# EAGLE design LB_BIT_i18_MOTIONTRIGGER-v02(rev1) (EAGLE 6.6.0)
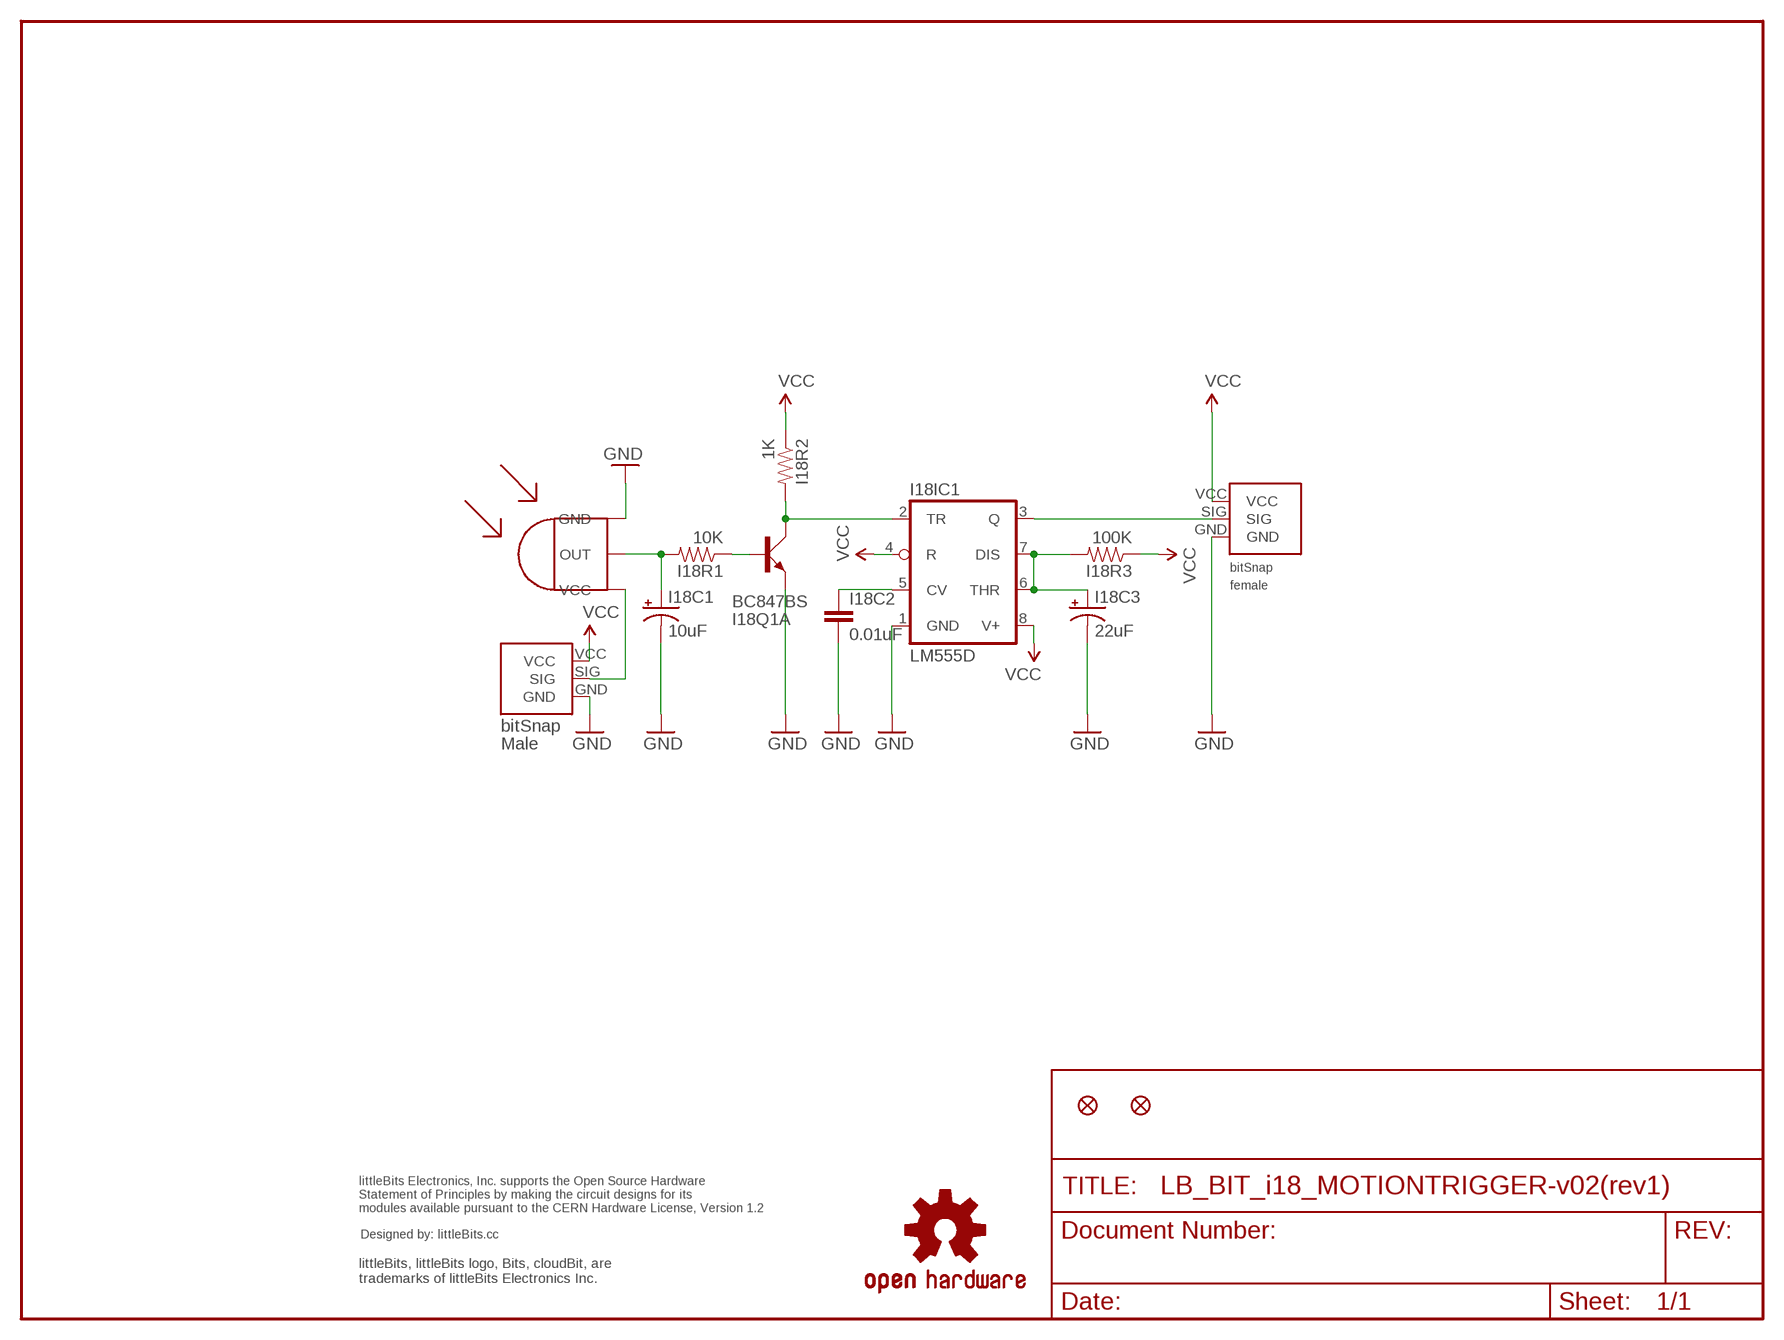
[diagram p0: schematic, sheet 1]

## Parts
I18BSF  BITSNAP_FEMALE  [BITSNAP_FEMALE]
I18BSM  BITSNAP_MALE  [BITSNAP_MALE]
I18C1  10uF  CAP_POL1206  [EIA3216]
I18C2  0.01uF  CAP0603-CAP  [0603-CAP]
I18C3  22uF  CAP_POL1206  [EIA3216]
I18FD1  FIDUCIAL1X2  [FIDUCIAL-1X2]
I18FD2  FIDUCIAL1X2  [FIDUCIAL-1X2]
I18IC1  LM555D  [SO08]
I18Q1  BC847BS  [SOT363_PHILIPS]
I18R1  10K  RESISTOR0603-RES  [0603-RES]
I18R2  1K  RESISTOR0603-RES  [0603-RES]
I18R3  100K  RESISTOR0603-RES  [0603-RES]
I18U1  PIR-EKMC1601112  [PIR-EKMC1601112]
U$1  OSHWCREDIT  [OSHWCREDIT]
U$2  OSHW-LOGOL  [OSHW-LOGO-L]

## Nets
GND: I18BSF.GND I18BSM.GND I18C1.C(-) I18C2.2 I18C3.C(-) I18IC1.1(GND) I18Q1.1(A:E) I18U1.GND
N$1: I18BSM.SIG I18U1.VCC
N$2: I18IC1.2(TR) I18Q1.6(A:C) I18R2.2
N$3: I18C1.A(+) I18R1.2 I18U1.OUT
N$4: I18Q1.2(A:B) I18R1.1
N$5: I18C2.1 I18IC1.5(CV)
N$6: I18C3.A(+) I18IC1.6(THR) I18IC1.7(DIS) I18R3.2
N$7: I18BSF.SIG I18IC1.3(Q)
VCC: I18BSF.VCC I18BSM.VCC I18IC1.4(R) I18IC1.8(V+) I18R2.1 I18R3.1
Unconnected: I18Q1.3(B:C) I18Q1.4(B:E) I18Q1.5(B:B)

## Library data of the parts
I18BSF = bitSnap:BITSNAP_FEMALE
I18BSM = bitSnap:BITSNAP_MALE
I18C1 I18C3 = SparkFun:CAP_POL: Capacitor Polarized These are standard SMD and PTH capacitors. Normally 10uF, 47uF, and 100uF in electrolytic and tantalum varieties. Always verify the external diameter of the through hole cap, it varies with capacity, voltage, and manufacturer. The EIA devices should be standard.
I18C2 = SparkFun:CAP: Capacitor Standard 0603 ceramic capacitor, and 0.1" leaded capacitor.
I18FD1 I18FD2 = SparkFun:FIDUCIAL: Fiducial Alignment Points Various fiducial points for machine vision alignment.
I18IC1 = linear:*555: TIMER
I18Q1 = transistor-small-signal:BC847BS: NPN general purpose double transistor Source: http://www.farnell.com/datasheets/2466.pdf
I18R1-I18R3 = SparkFun:RESISTOR: Resistor Basic schematic elements and footprints for 0603, 1206, and PTH 1/10th watt (small) resistors.
I18U1 = LITTLEBITS:PIR-EKMC1601112
U$1 = LITTLEBITS:OSHWCREDIT
U$2 = SparkFun_NEW:OSHW-LOGO: Open Source Hardware Logo This logo indicates the piece of hardware it is found on incorporates a OSHW license and/or adheres to the definition of open source hardware found here: http://freedomdefined.org/OSHW

## Board
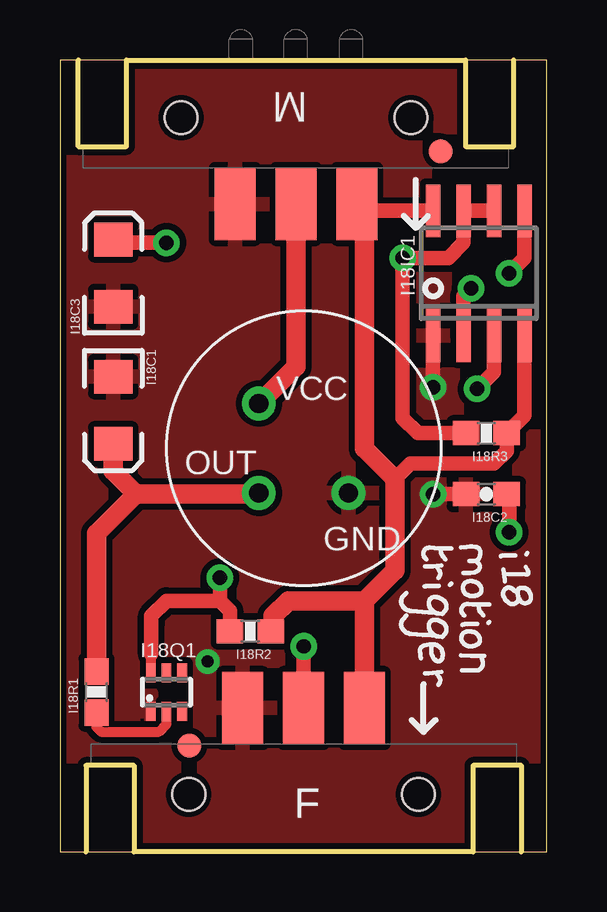
[diagram p1: board, top side]
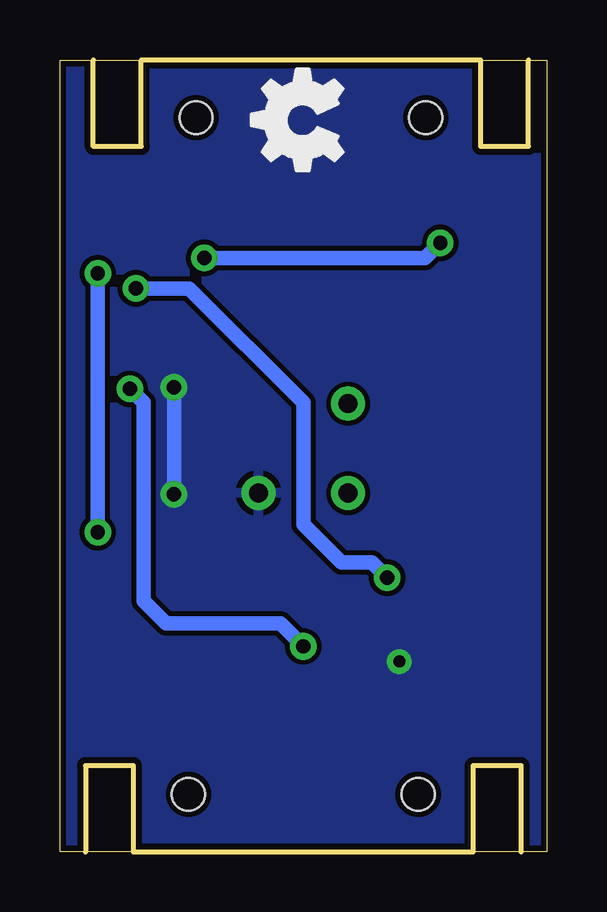
[diagram p2: board, bottom side, seen from below]

Size 20.31 x 33.02 mm. Coordinates in mm from the lower left corner, seen from the top.
Outline: 0,0 20.31,0 20.31,33.01 0,33.01 0,0
Copper layers (1*16): Top 0.035mm / dielectric 1.5mm / Bottom 0.035mm
Design rules "default": minimum track width 8mil, minimum drill 20mil, track to track 8mil, track to pad 8mil, pad to pad 8mil, via to via 8mil, smd to smd 8mil, copper to edge 10mil, drill to drill 8mil, minimum pad ring 12mil, minimum via ring 10mil, stop-mask expansion 4mil, vias tented up to drill 25mil, thermal gap 10mil

### Footprints (pad centres in the part's own frame; a part is rotated, then mirrored left to right if it is on the bottom)
BITSNAP_FEMALE = smd 1.7 x 3: GND 6.35,6; SIG 8.89,6; VCC 11.43,6 | hole 1.37: 13.68,2.41; 4.1,2.41
BITSNAP_MALE = smd 1.7 x 3: GND 11.43,6; SIG 8.89,6; VCC 6.35,6 | hole 1.37: 13.68,2.41; 4.1,2.41
EIA3216 = smd 1.4 x 1.6: A 1.4,0; C -1.4,0
0603-CAP = smd 1.1 x 1: 1 -0.85,0; 2 0.85,0
FIDUCIAL-1X2 = smd 1 x 1: 1 0,0
SO08 = smd 0.6 x 2.2: 1 -1.905,-2.6; 2 -0.635,-2.6; 3 0.635,-2.6; 4 1.905,-2.6; 5 1.905,2.6; 6 0.635,2.6; 7 -0.635,2.6; 8 -1.905,2.6
SOT363_PHILIPS = smd 0.4 x 0.8: 1 -0.65,-0.8; 2 0,-0.8; 3 0.65,-0.8; 4 0.65,0.8; 5 0,0.8; 6 -0.65,0.8
0603-RES = smd 1.1 x 1: 1 -0.85,0; 2 0.85,0
PIR-EKMC1601112 = drill 0.8: GND 1.865,-1.865; OUT -1.865,-1.865; VCC -1.865,1.865

### Placement (x,y rotation side)
I18BSF  1.27,0 0 top
I18BSM  18.73,33.02 180 top
I18C1  2.22,18.41 270 top
I18C2  17.78,14.92 180 top
I18C3  2.22,24.13 90 top
I18FD1  5.4,4.45 0 top
I18FD2  15.88,29.21 0 top
I18IC1  17.46,24.13 0 top
I18Q1  4.45,6.67 0 top
I18R1  1.52,6.67 90 top
I18R2  7.94,9.21 180 top
I18R3  17.78,17.46 180 top
I18U1  10.16,16.83 0 top
U$1  -18.1,-22.54 0 top  (outside the outline)
U$2  -13.97,-10.79 0 top  (outside the outline)
U$7  [OSHW_FILLX150_NOTEXT]  8.51,27.56 0 top
U$8  [I]  17.78,13.65 270 top
U$9  [1]  17.78,13.02 270 top
U$10  [8]  17.78,12.06 270 top
U$11  [M]  15.88,13.34 270 top
U$12  [O]  15.88,12.26 270 top
U$13  [T]  16.19,11.3 270 top
U$14  [I]  16.19,10.79 270 top
U$15  [O]  15.81,10.16 270 top
U$16  [N]  15.81,9.14 270 top
U$17  [T]  14.61,13.65 270 top
U$18  [R]  14.29,13.02 270 top
U$19  [I]  14.61,12.38 270 top
U$20  [G]  13.97,11.75 270 top
U$21  [G]  13.97,10.79 270 top
U$22  [E]  14.29,9.53 270 top
U$23  [R]  14.29,8.57 270 top

### Tracks (layer width: path | path; a pad name or v marks a point on that pad's centre or on a via)
GND  (via drill 0.5, 0.6)
  Top 0.406: 7.59,6.03 I18BSF.GND
  Top 0.61: v15.56,19.37 I18IC1.1 | I18C2.2 v15.56,14.92
  Bottom 0.61: v15.56,14.92 v15.56,19.37
  other vias: 6.16,7.94
  pour Top (isolate 0.254): 0.32,32.7 20,32.7 20,0.32 0.32,0.32
  pour Bottom: 0.32,32.7 20,32.7 20,0.32 0.32,0.32
N$1
  Top 0.813: I18BSM.SIG 9.84,20.24 I18U1.VCC
N$2  (via drill 0.6)
  Top 0.406: 3.81,9.53 3.79,9.51 | I18Q1.6 3.79,8.24 3.81,8.26
  Top 0.61: I18R2.2 7.09,10.06 6.67,10.48 | 6.67,10.48 4.45,10.48 3.81,9.84 3.81,9.53 3.81,8.26 | I18IC1.2 16.83,23.18 v17.14,23.5 | 6.67,10.48 v6.67,11.43
  Bottom 0.61: v17.14,23.5 14.92,23.5 10.16,18.73 10.16,13.65 8.57,12.06 7.3,12.06 v6.67,11.43
N$3
  Top 0.813: I18R1.2 1.52,13.27 3.17,14.92 | 3.17,14.92 8.26,14.92 I18U1.OUT | I18C1.A 2.22,15.88 3.17,14.92
N$4
  Top 0.406: I18R1.1 1.52,5.21 1.71,5.02 4.13,5.02 4.45,5.33 I18Q1.2
N$5  (via drill 0.6)
  Top 0.61: I18IC1.5 19.37,24.77 v18.73,24.13 | v18.73,13.34 18.73,14.82 I18C2.1
  Bottom 0.61: v18.73,13.34 v18.73,24.13
N$6  (via drill 0.6)
  Top 0.61: I18IC1.6 I18IC1.7 16.83,25.4 16.19,24.77 v14.29,24.77 14.29,18.1 14.92,17.46 I18R3.2 | v4.45,25.4 2.35,25.4 I18C3.A
  Bottom 0.61: v14.29,24.77 5.08,24.77 v4.45,25.4
N$7  (via drill 0.6)
  Top 0.61: I18IC1.3 18.1,20 v17.4,19.3 | I18BSF.SIG v10.16,8.57
  Bottom 0.61: v17.4,19.3 16.83,18.73 16.83,10.48 15.88,9.53 11.11,9.53 v10.16,8.57
VCC
  Top 0.61: 12.28,6.42 I18BSF.VCC | I18IC1.4 19.37,18.2 I18R3.1 18.63,16.73 18.1,16.19 14.61,16.19 13.97,15.56 | I18IC1.8 12.67,26.73 I18BSM.VCC
  Top 0.813: 12.7,10.48 13.97,11.75 13.97,15.56 12.7,16.83 12.7,26.7 I18BSM.VCC | 12.7,10.48 9.53,10.48 8.89,9.84 8.89,9.31 I18R2.1 | 12.28,6.42 12.63,6.42 12.7,6.35 12.7,10.48